# Altium schematic sheet SensorDesign.SchDoc
size A4; SheetNumber: 2; SheetTotal: 2
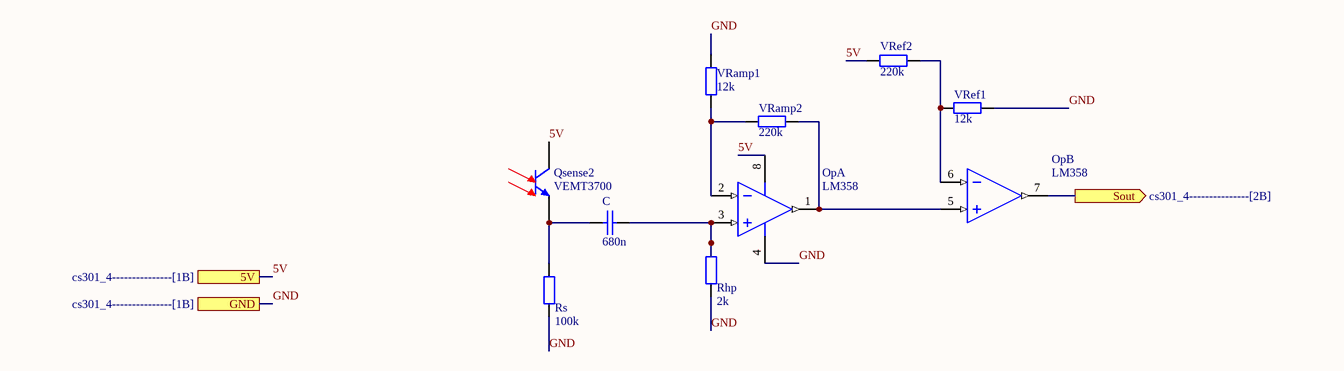
[diagram p0: SensorDesign.SchDoc]

## Parts
C  680n  [0805 CAP]
Op  LM358  [SO - 8]  (parts A,B of 2)
Qsense2  VEMT3700  [VEMT3700]
Rhp  2k  [0805 RES]
Rs  100k  [0805 RES]
VRamp1  12k  [0805 RES]
VRamp2  value 220k  [0805 RES]  (hidden comment: Res_SMT_0805)
VRef1  12k  [0805 RES]
VRef2  220k  [0805 RES]

## Ports
5V (see cs301_4---------------[1B]), GND (see cs301_4---------------[1B]), Sout (out, see cs301_4---------------[2B])

## Nets
5V: Op.8(VDD) Qsense2.1(C) VRef2.1 ; port 5V
GND: Op.4(VSS) Rhp.2 Rs.2 VRamp1.2 VRef1.2 ; port GND
Sout: Op.7(VOUTA) ; port Sout
NetC_1: C.1 Qsense2.2(E) Rs.1
NetC_2: C.2 Op.3(VINA+) Rhp.1
NetOp_1: Op.1(VOUTA) Op.5(VINA+) VRamp2.2
NetOp_2: Op.2(VINA-) VRamp1.1 VRamp2.1
NetOp_6: Op.6(VINA-) VRef1.1 VRef2.2

## Library data of the parts
C = CerCap_SMT_0805: SMT ceramic capacitor 0805 size; Value: 680n
Op = LM358_SMT_SOIC8: IC OPAMP 8SOIC; ComponentLink1URL: http://www.ti.com/lit/ds/symlink/tlc080a.pdf; ComponentLink1Description: http://www.ti.com/lit/ds/symlink/tlc080a.pdf; Supplier 1: Digi-Key; Supplier Part Number 1: 296-1014-1-ND
Qsense2 = VEMT3700: Silicon NPN Phototransistor
Rhp Rs VRamp1 VRef1 VRef2 = Res_SMT_0805: 0805 resistor; Published: 8-Jun-2000; LatestRevisionDate: 17-Jul-2002; LatestRevisionNote: Re-released for DXP Platform.; PackageReference: AXIAL-0.4; Publisher: Altium Limited; ComponentLink1Description: https://nz.mouser.com/datasheet/2/315/AOA0000C304-1149620.pdf
  Rhp: Value: 2k
  Rs: Value: 100k
  VRamp1 VRef1: Value: 12k
  VRef2: Value: 220k
VRamp2 = CMP-009-000002-1: 0805 resistor; Publisher: Altium Limited; Component Type: Standard; LatestRevisionNote: Re-released for DXP Platform.; PackageReference: AXIAL-0.4; Pin Count: 2; Published: 8-Jun-2000; Design Item ID: Res_SMT_0805; Source: EE209_SchLib.SchLib; LatestRevisionDate: 17-Jul-2002